# EAGLE schematic sensbaseGLCD (EAGLE 6.3)
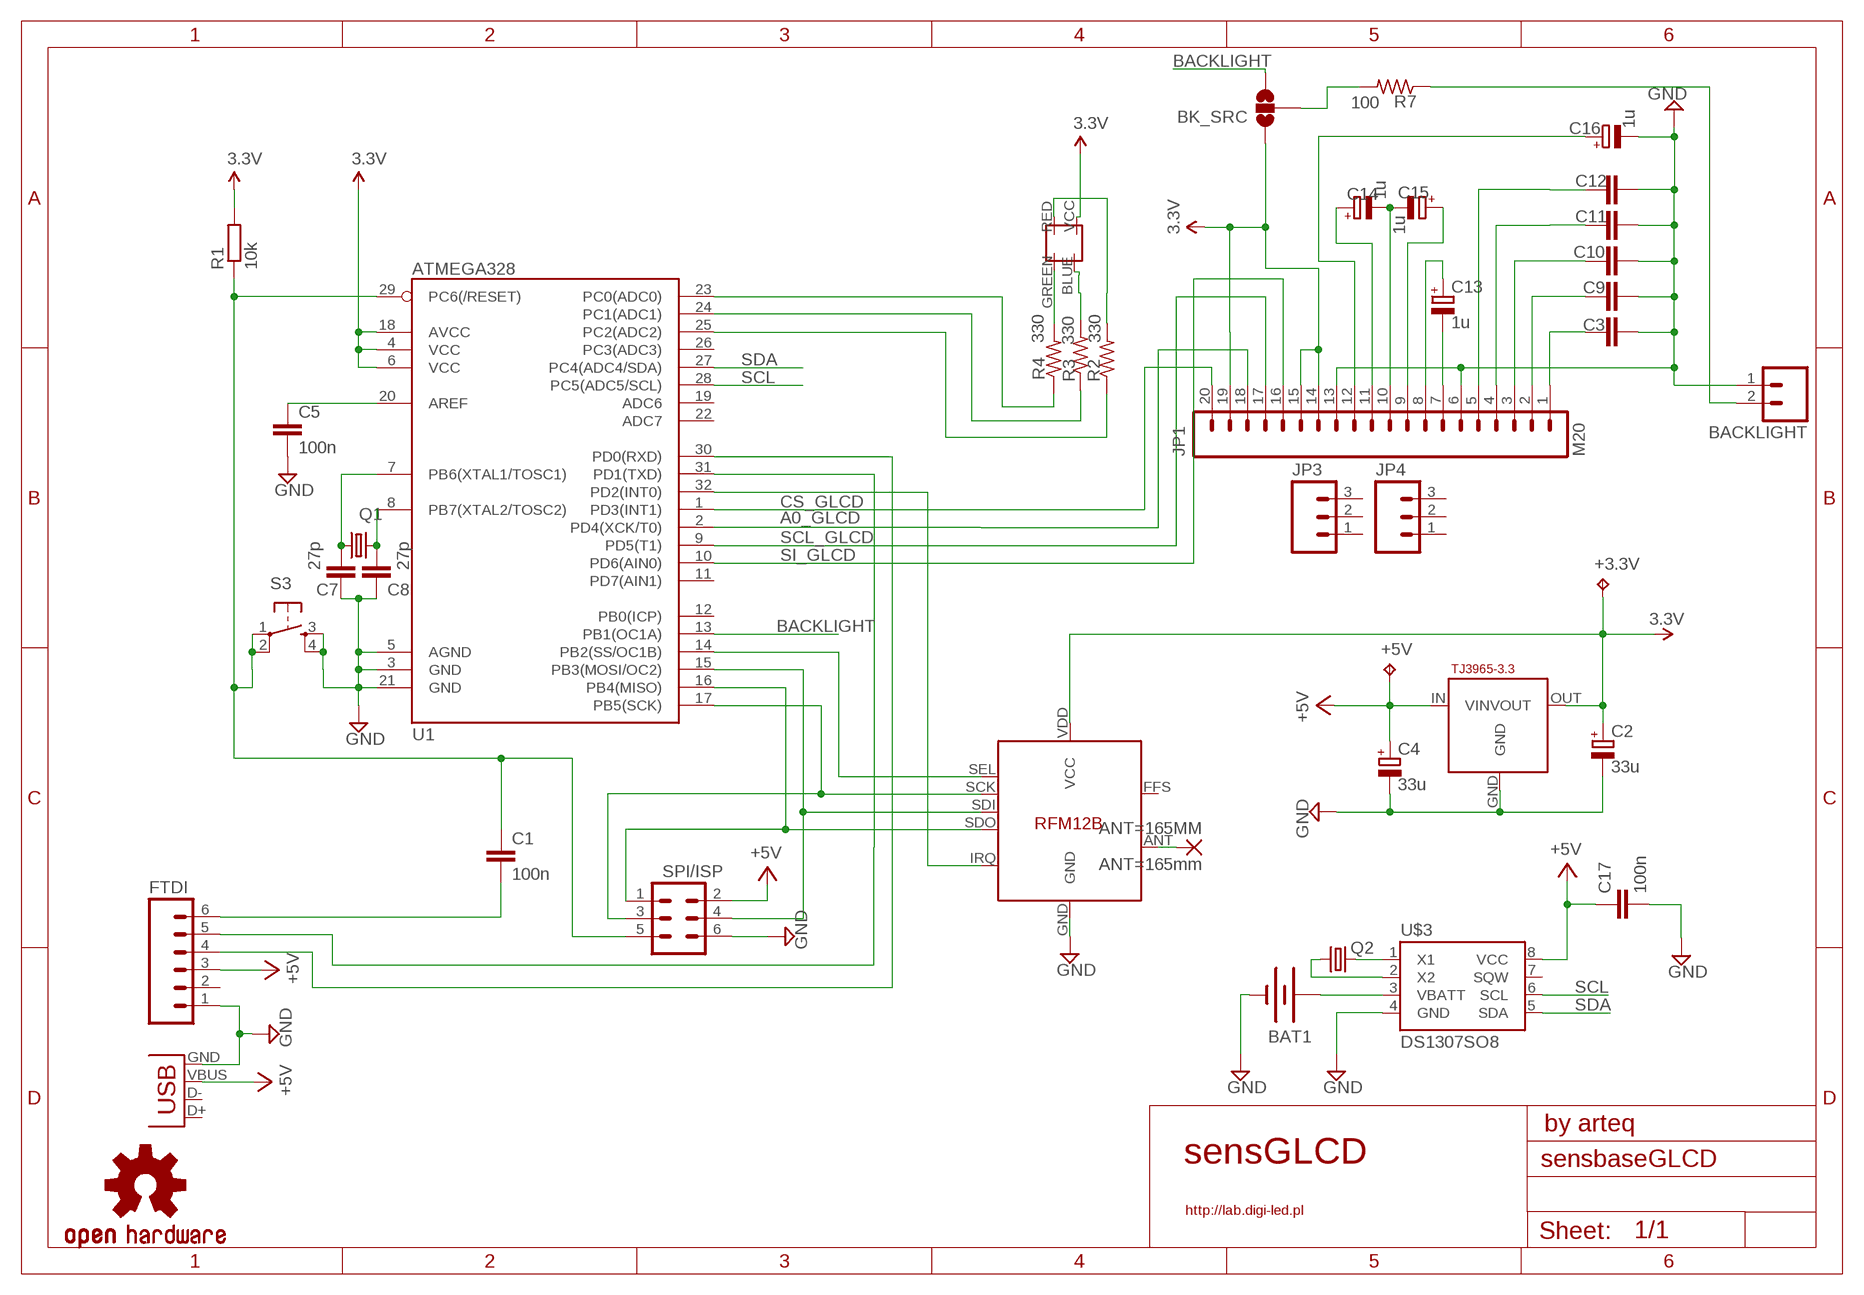
[diagram p0: schematic, sheet 1]

## Parts
3.3  TJ3965-3.3  [SOT223]
+3.3V  TPB1,27  [B1,27]
+5V  TPB1,27  [B1,27]
ANT=165MM  ANT=165mm  2,15/1,0  [2,15/1,0]
BACKLIGHT  M02PTH  [1X02]
BAT1  BATTERY20PTH  [BATTCOM_20MM_PTH]
BK_SRC  SOLDERJUMPER_2WAYT  [SJ_2]
C1  100n  C-EUC0805  [C0805]
C2  33u  CPOL-EUSMCB  [SMC_B]
C3  1u  C-EUC0805  [C0805]
C4  33u  CPOL-EUSMCB  [SMC_B]
C5  100n  C-EUC0805  [C0805]
C7  27p  C-EUC0805  [C0805]
C8  27p  C-EUC0805  [C0805]
C9  1u  C-EUC0805  [C0805]
C10  1u  C-EUC0805  [C0805]
C11  1u  C-EUC0805  [C0805]
C12  1u  C-EUC0805  [C0805]
C13  1u  CPOL-EUA/3216-18R  [A/3216-18R]
C14  1u  CPOL-EUA/3216-18R  [A/3216-18R]
C15  1u  CPOL-EUA/3216-18R  [A/3216-18R]
C16  1u  CPOL-EUA/3216-18R  [A/3216-18R]
C17  100n  C-EUC0805  [C0805]
FTDI  M06SIP  [1X06]
JP1  M20  [1X20]
JP3  M03PTH  [1X03]
JP4  M03PTH  [1X03]
Q1  CRYSTALHC49UP  [HC49UP]
Q2  CRYSTALTC26H  [TC26H]
R1  10k  R-EU_R0805  [R0805]
R2  330  R-US_R0805  [R0805]
R3  330  R-US_R0805  [R0805]
R4  330  R-US_R0805  [R0805]
R7  100  R-US_R0805  [R0805]
RF433  RFM12B  [RFM12B]
S3  TAC_SWITCHSMD  [TACTILE_SWITCH_SMD]
SV7  SPI/ISP  MA03-2  [MA03-2]
U1  ATMEGA328  ATMEGA168  [TQFP32-08]
U$2  OSHW-LOGOL  [OSHW-LOGO-L]
U$3  DS1307SO8  [SO08]
U$4  RGB1206  [RGB1206]
X1  USBSMD  [USB-MINIB]

## Nets
+5V [power]: 3.3.IN(VIN) +5V.TP C4.+ C17.1 FTDI.3 SV7.2 U$3.8(VCC) X1.VBUS
A0_GLCD: JP1.18 U1.2(PD4(XCK/T0))
BACKLIGHT: BK_SRC.3 U1.13(PB1(OC1A))
CS_GLCD [power]: JP1.20 U1.1(PD3(INT1))
GND [power]: 3.3.GND BACKLIGHT.1 BAT1.2(-) C2.- C3.2 C4.- C5.2 C7.2 C8.2 C9.2 C10.2 C11.2 C12.2 C16.- C17.2 FTDI.1 JP1.6 JP1.13 RF433.GND S3.3 S3.4 SV7.6 U1.3(GND) U1.5(AGND) U1.21(GND) U$3.4(GND) X1.GND
N$1: C7.1 Q1.1 U1.7(PB6(XTAL1/TOSC1))
N$2: RF433.SDO SV7.1 U1.16(PB4(MISO))
N$3: RF433.SDI SV7.4 U1.15(PB3(MOSI/OC2))
N$4: RF433.SEL U1.14(PB2(SS/OC1B))
N$5: RF433.SCK SV7.3 U1.17(PB5(SCK))
N$6: R4.2 U$4.GREEN(GR)
N$7: RF433.IRQ U1.32(PD2(INT0))
N$8: C1.2 FTDI.6
N$9: R2.2 U$4.RED(RE)
N$10: R3.2 U$4.BLUE(BL)
N$12: C5.1 U1.20(AREF)
N$13: BAT1.1(+) U$3.3(VBATT)
N$14: C1.1 R1.1 S3.1 S3.2 SV7.5 U1.29(PC6(/RESET))
N$15: C14.- C15.- JP1.10
N$16: Q2.2 U$3.2(X2)
N$17: Q2.1 U$3.1(X1)
N$18: ANT=165MM.1(P) RF433.ANT
N$19: C12.1 JP1.5
N$20: BK_SRC.2 R7.2
N$21: C8.1 Q1.2 U1.8(PB7(XTAL2/TOSC2))
N$22: C3.1 JP1.1
N$23: C13.+ JP1.8
N$24: C13.- JP1.7
N$25: R4.1 U1.23(PC0(ADC0))
N$26: R3.1 U1.24(PC1(ADC1))
N$27: R2.1 U1.25(PC2(ADC2))
N$29: C14.+ JP1.11
N$30: C15.+ JP1.9
N$32: C16.+ JP1.12
N$33: BACKLIGHT.2 R7.1
N$34: C9.1 JP1.2
N$35: C10.1 JP1.3
N$36: C11.1 JP1.4
RXD: FTDI.4 U1.30(PD0(RXD))
SCL: U1.28(PC5(ADC5/SCL)) U$3.6(SCL)
SCL_GLCD: JP1.17 U1.9(PD5(T1))
SDA: U1.27(PC4(ADC4/SDA)) U$3.5(SDA)
SI_GLCD: JP1.16 U1.10(PD6(AIN0))
TXD: FTDI.5 U1.31(PD1(TXD))
VCC [power]: 3.3.OUT(VOUT) +3.3V.TP BK_SRC.1 C2.+ JP1.14 JP1.15 JP1.19 R1.2 RF433.VDD(VCC) U1.4(VCC) U1.6(VCC) U1.18(AVCC) U$4.VCC ; supply symbol labelled 3.3V
Unconnected: FTDI.2 JP3.1 JP3.2 JP3.3 JP4.1 JP4.2 JP4.3 RF433.FFS U1.11(PD7(AIN1)) U1.12(PB0(ICP)) U1.19(ADC6) U1.22(ADC7) U1.26(PC3(ADC3)) U$3.7(SQW) X1.D+ X1.D-

## Notes on the sheet
- by arteq
- sensGLCD
- http://lab.digi-led.pl

## Library data of the parts
3.3 = artek:TJ3965-3.3: Stabilizator TJ3965S-3.3 firmy HTC
+3.3V +5V = testpad:TP: Test pad
ANT=165MM = wirepad:2,15/1,0: THROUGH-HOLE PAD
BACKLIGHT = SparkFun:M02: Header 2 Standard 2-pin 0.1" header. Use with straight break away headers (SKU : PRT-00116), right angle break away headers (PRT-00553), swiss pins (PRT-00743), machine pins (PRT-00117), and female headers (PRT-00115). Molex polarized connector foot print use with SKU : PRT-08233 with associated crimp pins and housings.
BAT1 = SparkFun:BATTERY: Battery Holders Various common sizes : AA, AAA, 20mm coin cell and 12mm coin cell.
BK_SRC = SparkFun:SOLDERJUMPER_2WAY: Solder Jumper 2 way solder jumper
C1 C3 C5 C7-C12 C17 = resistor:C-EU: CAPACITOR, European symbol
C2 C4 C13-C16 = resistor:CPOL-EU: POLARIZED CAPACITOR, European symbol
FTDI = SparkFun:M06: Header 6 Standard 6-pin 0.1" header. Use with straight break away headers (SKU : PRT-00116), right angle break away headers (PRT-00553), swiss pins (PRT-00743), machine pins (PRT-00117), and female headers (PRT-00115). Molex polarized connector foot print use with SKU : PRT-08094 with associated crimp pins and housings. NOTES ON THE VARIANTS LOCK and LOCK_LONGPADS... This footprint was designed to help hold the alignment of a through-hole component (i.e. 6-pin header) while soldering it into place. You may notice that each hole has been shifted either up or down by 0.005 of an inch from it's more standard position (which is a perfectly straight line). This slight alteration caused the pins (the squares in the middle) to touch the edges of the holes. Because they are alternating, it causes a "brace" to hold the component in place. 0.005 has proven to be the perfect amount of "off-center" position when using our standard breakaway headers. Although looks a little odd when you look at the bare footprint, once you have a header in there, the alteration is very hard to notice. Also, if you push a header all the way into place, it is covered up entirely on the bottom side. This idea of altering the position of holes to aid alignment will be further integrated into the Sparkfun Library for other footprints. It can help hold any component with 3 or more connection pins.
JP1 = SparkFun:M20: This is just like the LOCK variant in that the holes are staggared by 5 mil, but except for the last two holes. They are not altered from the "standard" footprint layout. This is used for a special purpose on the layout of our Graphic LCD Backpack. Make sure you want to use this device before selecting it for you project!
JP3 JP4 = SparkFun:M03: Header 3 Standard 3-pin 0.1" header. Use with straight break away headers (SKU : PRT-00116), right angle break away headers (PRT-00553), swiss pins (PRT-00743), machine pins (PRT-00117), and female headers (PRT-00115). Molex polarized connector foot print use with SKU : PRT-08232 with associated crimp pins and housings.
Q1 Q2 = crystal:CRYSTAL: CRYSTAL; OC_FARNELL: unknown; OC_NEWARK: unknown
R1 = resistor:R-EU_: RESISTOR, European symbol
R2-R4 R7 = rcl:R-US_: RESISTOR, American symbol
RF433 = JeeLabs:RFM12B
S3 = SparkFun:TAC_SWITCH: Momentary Switch Button commonly used for reset or general input. Spark Fun Electronics SKU : COM-00097
SV7 = con-lstb:MA03-2: PIN HEADER
U1 = SparkFun:ATMEGA168
U$2 = SparkFun:OSHW-LOGO: Open Source Hardware Logo This logo indicates the piece of hardware it is found on incorporates a OSHW license and/or adheres to the definition of open source hardware found here: http://freedomdefined.org/OSHW
U$3 = SparkFun:DS1307
U$4 = artek:RGB1206
X1 = SparkFun:USB: USB Connectors USB-B-PTH is fully proven SKU : PRT-00139 USB-miniB is fully proven SKU : PRT-00587 USB-A-PCB is untested. USB-A-H is throughly reviewed, but untested. Spark Fun Electronics SKU : PRT-00437 USB-B-SMT is throughly reviewed, but untested. Needs silkscreen touching up. USB-A-S has not been used/tested USB-MB-H has not been used/tested